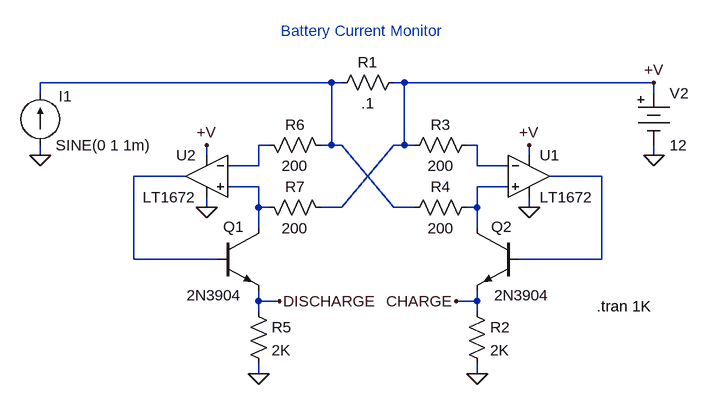
[diagram p0: schematic 1672.asc]
1672.asc, the LTspice schematic file:
Version 4
SHEET 1 1504 680
WIRE 0 64 -448 64
WIRE 16 64 0 64
WIRE 112 64 96 64
WIRE 496 64 112 64
WIRE -448 80 -448 64
WIRE 496 80 496 64
WIRE -96 160 -112 160
WIRE 0 160 0 64
WIRE 0 160 -16 160
WIRE 16 160 0 160
WIRE 112 160 112 64
WIRE 112 160 96 160
WIRE 128 160 112 160
WIRE 224 160 208 160
WIRE -448 176 -448 160
WIRE -192 176 -192 160
WIRE 304 176 304 160
WIRE 496 176 496 160
WIRE -112 192 -112 160
WIRE -112 192 -160 192
WIRE 224 192 224 160
WIRE 272 192 224 192
WIRE -224 208 -304 208
WIRE 416 208 336 208
WIRE -112 224 -160 224
WIRE 272 224 224 224
WIRE -192 256 -192 240
WIRE -112 256 -112 224
WIRE -96 256 -112 256
WIRE 16 256 96 160
WIRE 16 256 -16 256
WIRE 96 256 16 160
WIRE 128 256 96 256
WIRE 224 256 224 224
WIRE 224 256 208 256
WIRE 304 256 304 240
WIRE -112 288 -112 256
WIRE 224 288 224 256
WIRE -304 336 -304 208
WIRE -176 336 -304 336
WIRE 416 336 416 208
WIRE 416 336 288 336
WIRE -112 400 -112 384
WIRE -80 400 -112 400
WIRE 224 400 224 384
WIRE 224 400 192 400
WIRE -112 416 -112 400
WIRE 224 416 224 400
WIRE -112 512 -112 496
WIRE 224 512 224 496
FLAG 304 160 +V
FLAG 496 64 +V
FLAG 304 256 0
FLAG 224 512 0
FLAG -192 160 +V
FLAG -192 256 0
FLAG -112 512 0
FLAG 496 176 0
FLAG -448 176 0
FLAG -80 400 DISCHARGE
FLAG 192 400 CHARGE
SYMBOL res 112 48 R90
WINDOW 0 0 56 VBottom 2
WINDOW 3 32 56 VTop 2
SYMATTR InstName R1
SYMATTR Value .1
SYMBOL opamps\\LT1672 304 208 R0
SYMATTR InstName U1
SYMBOL npn 288 288 M0
WINDOW 0 42 -2 Right 2
WINDOW 3 38 103 Right 2
SYMATTR InstName Q2
SYMATTR Value 2N3904
SYMBOL res 208 400 R0
SYMATTR InstName R2
SYMATTR Value 2K
SYMBOL res 224 144 R90
WINDOW 0 0 56 VBottom 2
WINDOW 3 32 56 VTop 2
SYMATTR InstName R3
SYMATTR Value 200
SYMBOL res 224 240 R90
WINDOW 0 0 56 VBottom 2
WINDOW 3 32 56 VTop 2
SYMATTR InstName R4
SYMATTR Value 200
SYMBOL opamps\\LT1672 -192 208 M0
SYMATTR InstName U2
SYMBOL npn -176 288 R0
WINDOW 0 42 -2 Right 2
WINDOW 3 38 103 Right 2
SYMATTR InstName Q1
SYMATTR Value 2N3904
SYMBOL res -128 400 R0
SYMATTR InstName R5
SYMATTR Value 2K
SYMBOL res -112 144 M90
WINDOW 0 0 56 VBottom 2
WINDOW 3 32 56 VTop 2
SYMATTR InstName R6
SYMATTR Value 200
SYMBOL res -112 240 M90
WINDOW 0 0 56 VBottom 2
WINDOW 3 32 56 VTop 2
SYMATTR InstName R7
SYMATTR Value 200
SYMBOL current -448 160 M180
WINDOW 0 28 75 Left 2
WINDOW 3 24 0 Left 2
WINDOW 123 0 0 Left 2
WINDOW 39 0 0 Left 2
SYMATTR InstName I1
SYMATTR Value SINE(0 1 1m)
SYMBOL misc\\battery 496 64 R0
SYMATTR InstName V2
SYMATTR Value 12
TEXT 408 408 Left 2 !.tran 1K
TEXT 48 0 Bottom 2 ;Battery Current Monitor

The netlist it stands for:
* 1672.asc
R1 +V N001 .1
* U1: LT1672 (symbol opamps\LT1672 not available, pins judged from their places): In+=N007 In-=N003 V+=+V V-=0 OUT=N005
Q2 N007 N005 CHARGE 0 2N3904
R2 CHARGE 0 2K
R3 N003 +V 200
R4 N007 N001 200
* U2: LT1672 (symbol opamps\LT1672 not available, pins judged from their places): In+=N006 In-=N002 V+=+V V-=0 OUT=N004
Q1 N006 N004 DISCHARGE 0 2N3904
R5 DISCHARGE 0 2K
R6 N002 N001 200
R7 N006 +V 200
I1 0 N001 SINE(0 1 1m)
V2 +V 0 12
.model NPN NPN
.model PNP PNP
.lib standard.bjt
.tran 1K
* Battery Current Monitor
.backanno
.end